# Altium project Socket.PrjPCB
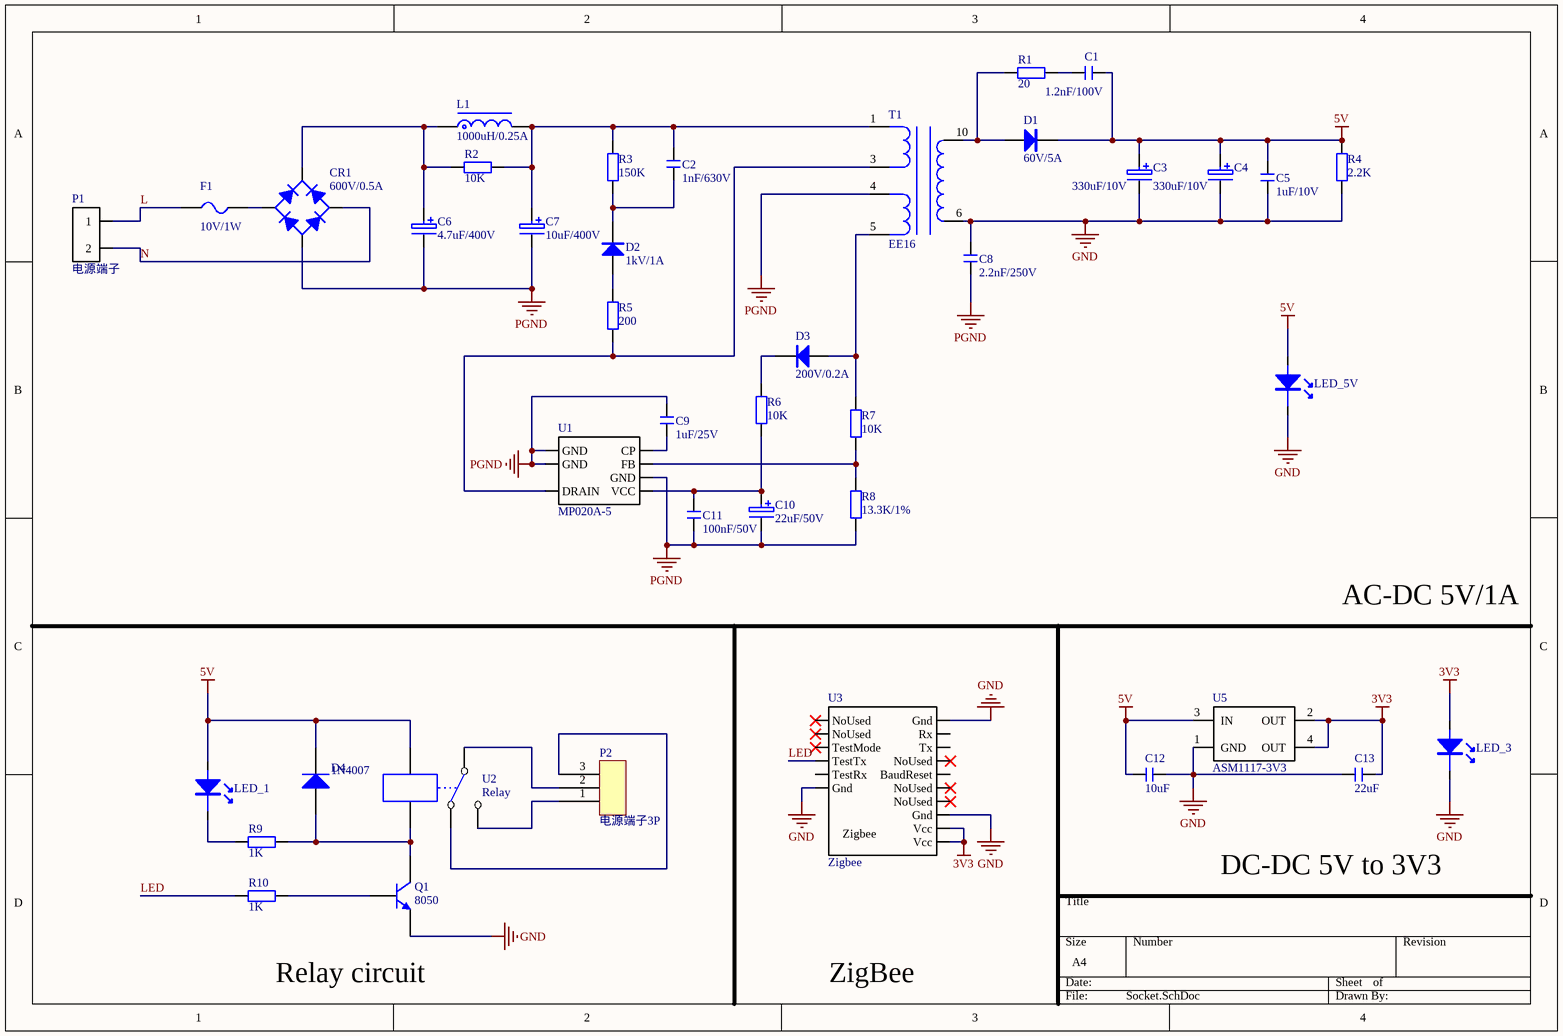
[diagram p0: Socket.SchDoc]
1 sheet, 41 parts. Net scope: global (net labels, ports and power ports of the same name join across sheets).
Board file: Socket.PcbDoc

## Sheet Socket.SchDoc
size A4

### Parts
C1  1.2nF/100V  [C1206]
C2  1nF/630V  [C1206]
C3  330uF/10V  [C10x16]
C4  330uF/10V  [C10x16]
C5  1uF/10V  [C1206]
C6  4.7uF/400V  [C6.3*7]
C7  10uF/400V  [C6.3*7]
C8  2.2nF/250V  [C1206]
C9  1uF/25V  [C1206]
C10  22uF/50V  [C10x16]
C11  100nF/50V  [C1206]
C12  10uF  [C1206]
C13  22uF  [C1206]
CR1  600V/0.5A  [MBS]
D1  60V/5A  [SMC]
D2  1kV/1A  [DO-41]
D3  200V/0.2A  [SOD123]
D4  1N4007  [DO-41]
F1  10V/1W  [FU 1812]
L1  1000uH/0.25A  [PK0810]
LED_1  LED_G  [LED1206G]  (value not drawn)
LED_3  LED_G  [LED1206G]  (value not drawn)
LED_5V  LED_G  [LED1206G]  (value not drawn)
P1  电源端子  [KF128-5.08-2P]
P2  电源端子3P  [KF128-5.08-3P]
Q1  8050  [SOT-23B_N]
R1  20  [R1206]
R2  10K  [R1206]
R3  150K  [R1206]
R4  2.2K  [R1206]
R5  200  [R1206]
R6  10K  [R1206]
R7  10K  [R1206]
R8  13.3K/1%  [R1206]
R9  1K  [R1206]
R10  1K  [R1206]
T1  EE16  [EE16]
U1  MP020A-5  [SOIC8-7A]
U2  Relay  [SRD-C_Y]
U3  Zigbee  [DL-LN_MODE]
U5  ASM1117-3V3  [SOT-223]

### Nets
3V3: C13.2 LED_3.1(A) U3.7(Vcc) U3.8(Vcc) U5.2(OUT) U5.4(OUT)
5V: C1.2 C3.1 C4.1 C5.2 C12.1 D1.2(K) D4.2(K) LED_1.1(A) LED_5V.1(A) R4.2 U2.1 U5.3(IN)
GND: C3.2 C4.2 C5.1 C8.2 C12.2 C13.1 LED_3.2(K) LED_5V.2(K) Q1.3(E) R4.1 T1.6 U3.6(Gnd) U3.9(Gnd) U3.16(Gnd) U5.1(GND)
PGND: C6.2 C7.2 C8.1 C9.2 C10.2 C11.1 CR1.DC- R8.1 T1.4 U1.2(GND) U1.5(GND) U1.6(GND)
L: F1.1 P1.1
LED: R10.2 U3.4(TestTx)
N: CR1.AC1 P1.2
NetC1_1: C1.1 R1.2
NetC2_1: C2.1 D2.2(K) R3.1
NetC2_2: C2.2 C7.1 L1.2 R2.2 R3.2 T1.1
NetC6_1: C6.1 CR1.DC+ L1.1 R2.1
NetC9_1: C9.1 U1.4(CP)
NetC10_1: C10.1 C11.2 R6.1 U1.1(VCC)
NetCR1_AC2: CR1.AC2 F1.2
NetD1_1: D1.1(A) R1.1 T1.10
NetD2_1: D2.1(A) R5.2
NetD3_1: D3.1(A) R7.2 T1.5
NetD3_2: D3.2(K) R6.2
NetD4_1: D4.1(A) Q1.1(C) R9.1 U2.2
NetLED_1_2: LED_1.2(K) R9.2
NetP2_1: P2.1 U2.5
NetP2_2: P2.2 U2.3
NetP2_3: P2.3 U2.4
NetQ1_2: Q1.2(B) R10.1
NetR5_1: R5.1 T1.3 U1.8(DRAIN)
NetR7_1: R7.1 R8.2 U1.3(FB)

Not connected (* = marked no-connect by the designer): U3 1(NoUsed)* 2(NoUsed)* 3(TestMode)* 5(TestRx) 10(NoUsed)* 11(NoUsed)* 12(BaudReset) 13(NoUsed)* 14(Tx) 15(Rx)

### Notes on the sheet
- AC-DC 5V/1A
- DC-DC 5V to 3V3
- Relay circuit
- ZigBee

### Library data of the parts
C1 C2 C5 C8 C9 C11-C13 = Cap_C1206: 无极性贴片电容; 版权归属: 源创客; BOM名称: 无极性贴片电容; 学习资源: www.ooocke.com
C3 C4 C10 = Cap_E_Middle: CAP 10*16; BOM名称: 直插电解电容; 版权归属: 源创客; 学习资源: www.ooocke.com
C6 C7 = Cap_E_Small: CAP 6.3*7; BOM名称: 直插电解电容; 版权归属: 源创客; 学习资源: www.ooocke.com
CR1 = MB6S: 600V/1A整流桥; BOM名称: 700V/1A整流桥; 版权归属: 源创客; 学习资源: www.ooocke.com
D1 = B560C: 肖特基二极管; 版权归属: 源创客; 属性: 40V/1A; BOM名称: 肖特基二极管; 学习资源: www.ooocke.com
D2 = FR107: 快恢复整流二极管; BOM名称: 快恢复二极管; 版权归属: 源创客; 属性: 700V/1A; 学习资源: www.ooocke.com
D3 = BAV21W: 高速开关二极管; 版权归属: 源创客; BOM名称: 高速开关二极管; 学习资源: www.ooocke.com
D4 = Diode 1N4007: 1 Amp General Purpose Rectifier; Published: 8-Jun-2000; LatestRevisionDate: 17-Jul-2002; LatestRevisionNote: Re-released for DXP Platform.; DatasheetVersion: 1998; PackageVersion: Aug-1999; PackageReference: DO-41; Publisher: Altium Limited; PackageDescription: Diode, Axial; Body 5.2 x 2.7 mm (LxDia. max), Lead Dia. 0.86 mm (max); Code_JEDEC: DO-204-AL; ComponentLink1Description: Manufacturer Link; ComponentLink1URL: http://www.fairchildsemi.com/; ComponentLink2Description: Datasheet; ComponentLink2URL: http://www.fairchildsemi.com/ds/1N%2F1N4001.pdf
F1 = FUSE: 贴片保险丝_1812; BOM名称: 贴片保险丝; 版权归属: 源创客; 学习资源: www.ooocke.com
L1 = L-PK: 工字电感; 版权归属: 源创客; BOM名称: 工字电感; 学习资源: www.ooocke.com
LED_1 LED_3 LED_5V = LED_G: 1206
P1 = 电源端子: 电源端子2P
Q1 = QNPN: 型号8050 NPN Bipolar Transistor; Published: 8-Jun-2000; LatestRevisionDate: 29-May-2009; LatestRevisionNote: IPC-7351 Footprint Added.; PackageVersion: Aug-1999; PackageReference: SOT-23B; Publisher: Altium Limited; PackageDescription: 3-Pin SOT-23 Package 0.95 mm Pitch, 2.4 mm Lead Span
R1-R10 = Res: 1206
T1 = EE16: 高频变压器; ROM名称: 12V 高频变压器; 版权归属: 源创客; 学习资源: www.ooocke.com
U1 = MP020A-5: AC-DC
U2 = Relay: 继电器
U3 = Zigbee: DL-LN33
U5 = ASM1117-3V3: 3V3稳压芯片